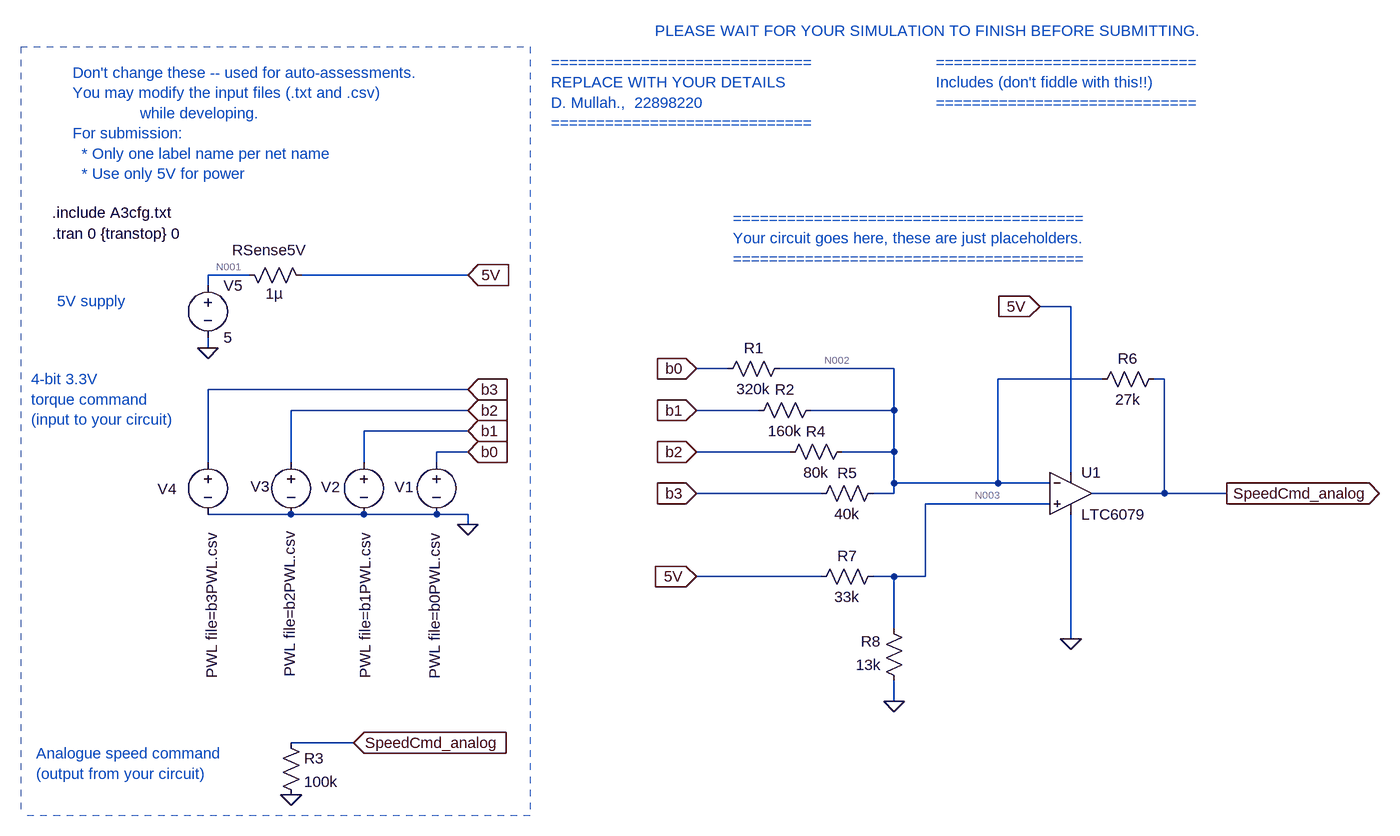
[diagram p0: schematic E344_Ass3_DAC.asc]
E344_Ass3_DAC.asc, the LTspice schematic file:
Version 4
SHEET 1 1824 2192
WIRE -2016 -1072 -2080 -1072
WIRE -1680 -1072 -1936 -1072
WIRE -2080 -1056 -2080 -1072
WIRE -752 -1024 -800 -1024
WIRE -2080 -960 -2080 -976
WIRE -1280 -928 -1328 -928
WIRE -1024 -928 -1200 -928
WIRE -704 -912 -864 -912
WIRE -608 -912 -624 -912
WIRE -1680 -896 -2080 -896
WIRE -1680 -864 -1952 -864
WIRE -1232 -864 -1328 -864
WIRE -1024 -864 -1024 -928
WIRE -1024 -864 -1152 -864
WIRE -1680 -832 -1840 -832
WIRE -1680 -800 -1728 -800
WIRE -1184 -800 -1328 -800
WIRE -1024 -800 -1024 -864
WIRE -1024 -800 -1104 -800
WIRE -2080 -784 -2080 -896
WIRE -1952 -784 -1952 -864
WIRE -1840 -784 -1840 -832
WIRE -1728 -784 -1728 -800
WIRE -752 -768 -752 -1024
WIRE -1024 -752 -1024 -800
WIRE -864 -752 -864 -912
WIRE -864 -752 -1024 -752
WIRE -784 -752 -864 -752
WIRE -1136 -736 -1328 -736
WIRE -1024 -736 -1024 -752
WIRE -1024 -736 -1056 -736
WIRE -608 -736 -608 -912
WIRE -608 -736 -720 -736
WIRE -512 -736 -608 -736
WIRE -784 -720 -976 -720
WIRE -1952 -704 -2080 -704
WIRE -1840 -704 -1952 -704
WIRE -1728 -704 -1840 -704
WIRE -1680 -704 -1728 -704
WIRE -1680 -688 -1680 -704
WIRE -1136 -608 -1328 -608
WIRE -1024 -608 -1056 -608
WIRE -976 -608 -976 -720
WIRE -976 -608 -1024 -608
WIRE -1024 -528 -1024 -608
WIRE -752 -512 -752 -704
WIRE -1024 -416 -1024 -448
WIRE -1856 -352 -1952 -352
FLAG -1680 -1072 5V
IOPIN -1680 -1072 In
FLAG -2080 -960 0
FLAG -800 -1024 5V
IOPIN -800 -1024 In
FLAG -512 -736 SpeedCmd_analog
IOPIN -512 -736 Out
FLAG -1680 -688 0
FLAG -1680 -896 b3
IOPIN -1680 -896 In
FLAG -1680 -864 b2
IOPIN -1680 -864 In
FLAG -1680 -832 b1
IOPIN -1680 -832 In
FLAG -1680 -800 b0
IOPIN -1680 -800 In
FLAG -1328 -736 b3
IOPIN -1328 -736 In
FLAG -1328 -800 b2
IOPIN -1328 -800 In
FLAG -1328 -864 b1
IOPIN -1328 -864 In
FLAG -1328 -928 b0
IOPIN -1328 -928 In
FLAG -1856 -352 SpeedCmd_analog
IOPIN -1856 -352 In
FLAG -1952 -272 0
FLAG -1024 -416 0
FLAG -1328 -608 5V
IOPIN -1328 -608 In
FLAG -752 -512 0
SYMBOL voltage -2080 -1072 R0
WINDOW 123 0 0 Left 0
WINDOW 39 0 0 Left 0
SYMATTR InstName V5
SYMATTR Value 5
SYMBOL res -2032 -1088 M90
WINDOW 0 -7 47 VBottom 2
WINDOW 3 29 54 VTop 2
SYMATTR InstName RSense5V
SYMATTR Value 1µ
SYMBOL voltage -1728 -800 R0
WINDOW 3 -3 125 VRight 2
WINDOW 123 0 0 Left 0
WINDOW 39 0 0 Left 0
WINDOW 0 -65 54 Left 2
SYMATTR Value PWL file=b0PWL.csv
SYMATTR InstName V1
SYMBOL voltage -1840 -800 R0
WINDOW 3 2 124 VRight 2
WINDOW 123 0 0 Left 0
WINDOW 39 0 0 Left 0
WINDOW 0 -66 54 Left 2
SYMATTR Value PWL file=b1PWL.csv
SYMATTR InstName V2
SYMBOL voltage -1952 -800 R0
WINDOW 3 -2 122 VRight 2
WINDOW 123 0 0 Left 0
WINDOW 39 0 0 Left 0
WINDOW 0 -62 53 Left 2
SYMATTR Value PWL file=b2PWL.csv
SYMATTR InstName V3
SYMBOL voltage -2080 -800 R0
WINDOW 3 6 124 VRight 2
WINDOW 123 0 0 Left 0
WINDOW 39 0 0 Left 0
WINDOW 0 -77 57 Left 2
SYMATTR Value PWL file=b3PWL.csv
SYMATTR InstName V4
SYMBOL res -1968 -368 R0
SYMATTR InstName R3
SYMATTR Value 100k
SYMBOL OpAmps\\LTC6079 -752 -736 R0
SYMATTR InstName U1
SYMBOL res -1184 -944 R90
WINDOW 0 0 56 VBottom 2
WINDOW 3 32 56 VTop 2
SYMATTR InstName R1
SYMATTR Value 320k
SYMBOL res -1136 -880 R90
WINDOW 0 0 56 VBottom 2
WINDOW 3 32 56 VTop 2
SYMATTR InstName R2
SYMATTR Value 160k
SYMBOL res -1088 -816 R90
WINDOW 0 0 56 VBottom 2
WINDOW 3 32 56 VTop 2
SYMATTR InstName R4
SYMATTR Value 80k
SYMBOL res -1040 -752 R90
WINDOW 0 0 56 VBottom 2
WINDOW 3 32 56 VTop 2
SYMATTR InstName R5
SYMATTR Value 40k
SYMBOL res -608 -928 R90
WINDOW 0 0 56 VBottom 2
WINDOW 3 32 56 VTop 2
SYMATTR InstName R6
SYMATTR Value 27k
SYMBOL res -1040 -624 R90
WINDOW 0 0 56 VBottom 2
WINDOW 3 32 56 VTop 2
SYMATTR InstName R7
SYMATTR Value 33k
SYMBOL res -1008 -432 R180
WINDOW 0 36 76 Left 2
WINDOW 3 36 40 Left 2
SYMATTR InstName R8
SYMATTR Value 13k
TEXT -2288 -1384 Left 2 ;Don't change these -- used for auto-assessments.\nYou may modify the input files (.txt and .csv) \n               while developing.\nFor submission: \n  * Only one label name per net name\n  * Use only 5V for power
TEXT -1552 -1400 Left 2 ;=============================\nREPLACE WITH YOUR DETAILS\nD. Mullah.,  22898220\n=============================
TEXT -960 -1400 Left 2 ;=============================\nIncludes (don't fiddle with this!!)\n=============================
TEXT -1272 -1160 Left 2 ;=======================================\nYour circuit goes here, these are just placeholders.\n=======================================
TEXT -1392 -1448 Left 2 ;PLEASE WAIT FOR YOUR SIMULATION TO FINISH BEFORE SUBMITTING.
TEXT -2320 -1136 Left 2 !.tran 0 {transtop} 0
TEXT -2320 -1168 Left 2 !.include A3cfg.txt
TEXT -2312 -1032 Left 2 ;5V supply
TEXT -2352 -912 Left 2 ;4-bit 3.3V\ntorque command\n(input to your circuit)
TEXT -2344 -336 Left 2 ;Analogue speed command\n(output from your circuit)
LINE Normal -1584 -1424 -1584 -240 2
LINE Normal -2368 -1424 -1584 -1424 2
LINE Normal -1584 -240 -2368 -240 2
LINE Normal -1584 -256 -1584 -256 2
LINE Normal -2368 -1424 -2368 -240 2

The netlist it stands for:
* E344_Ass3_DAC.asc
V5 N001 0 5
RSense5V N001 5V 1µ
V1 b0 0 PWL file=b0PWL.csv
V2 b1 0 PWL file=b1PWL.csv
V3 b2 0 PWL file=b2PWL.csv
V4 b3 0 PWL file=b3PWL.csv
R3 SpeedCmd_analog 0 100k
XU1 N003 N002 5V 0 SpeedCmd_analog LTC6078  ; LTC6079, pins In+ In- V+ V- OUT
R1 N002 b0 320k
R2 N002 b1 160k
R4 N002 b2 80k
R5 N002 b3 40k
R6 SpeedCmd_analog N002 27k
R7 N003 5V 33k
R8 0 N003 13k
* Don't change these -- used for auto-assessments.
* You may modify the input files (.txt and .csv)
*                while developing.
* For submission:
*   * Only one label name per net name
*   * Use only 5V for power
* =============================
* REPLACE WITH YOUR DETAILS
* D. Mullah.,  22898220
* =============================
* =============================
* Includes (don't fiddle with this!!)
* =============================
* =======================================
* Your circuit goes here, these are just placeholders.
* =======================================
* PLEASE WAIT FOR YOUR SIMULATION TO FINISH BEFORE SUBMITTING.
.tran 0 {transtop} 0
.include A3cfg.txt
* 5V supply
* 4-bit 3.3V
* torque command
* (input to your circuit)
* Analogue speed command
* (output from your circuit)
.lib LTC5.lib
.backanno
.end

* Results of the author's LTspice run, read from the files saved beside the schematic
* Operating Point, zero values left out:
*   V(n001) = 5 V
*   V(5v) = 5 V
*   V(speedcmd_analog) = 3.201 V
*   V(n003) = 1.413 V
*   V(n002) = 1.413 V
*   I(R8) = -108.7 µA
*   I(R7) = -108.7 µA
*   I(R6) = 66.24 µA
*   I(R5) = 35.33 µA
*   I(R4) = 17.66 µA
*   I(R2) = 8.832 µA
*   I(R1) = 4.416 µA
*   I(R3) = 32.01 µA
*   I(Rsense5v) = 244.3 µA
*   I(V4) = 35.33 µA
*   I(V3) = 17.66 µA
*   I(V2) = 8.832 µA
*   I(V1) = 4.416 µA
*   I(V5) = -244.3 µA
*   Ix(u1:3) = 135.6 µA
*   Ix(u1:4) = -37.39 µA
*   Ix(u1:5) = -98.25 µA
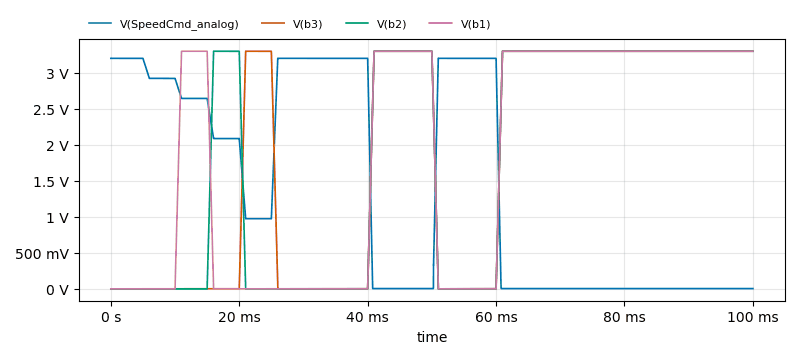
[diagram p1: Transient Analysis of E344_Ass3_DAC.asc, plotted from the saved traces]
* Transient Analysis, 1 run:
*   V(SpeedCmd_analog): min 2.743 mV, max 3.203 V, average 1.399 V, rms 2.021 V, last 3.639 mV
*   V(b3): min 0 V, max 3.3 V, average 1.798 V, rms 2.418 V, last 3.3 V
*   V(b2): min 0 V, max 3.3 V, average 1.798 V, rms 2.419 V, last 3.3 V
*   V(b1): min 0 V, max 3.3 V, average 1.798 V, rms 2.422 V, last 3.3 V